# Altium schematic sheet B9_HashBoard.SchDoc
size A4
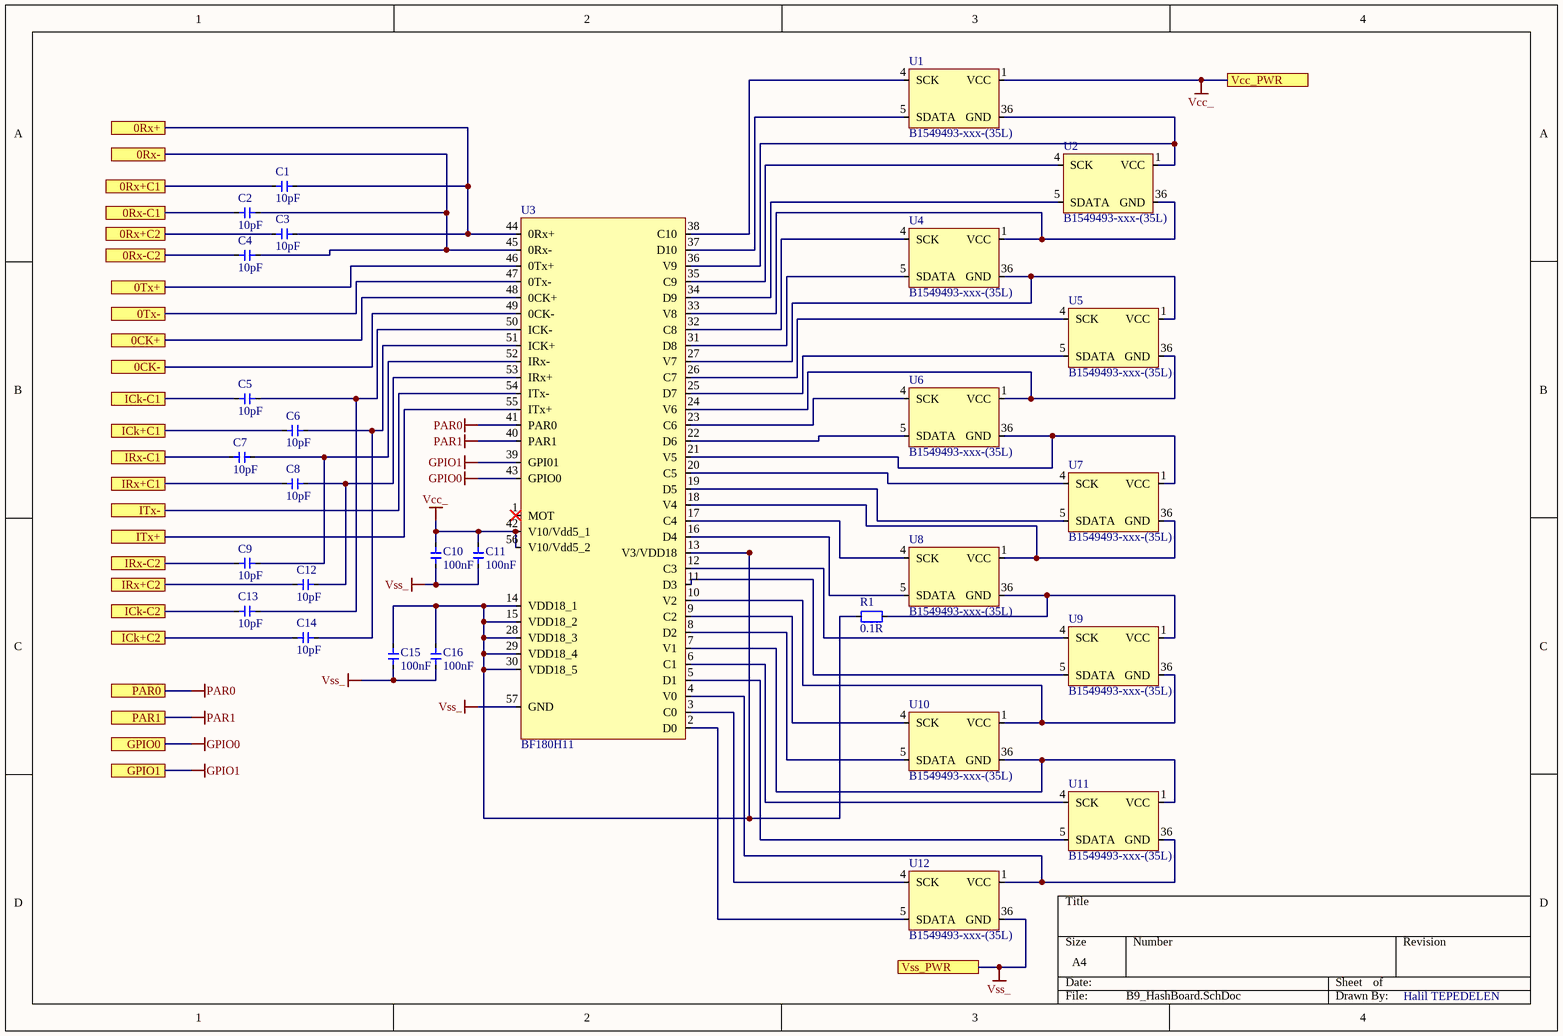
[diagram p0: B9_HashBoard.SchDoc]

## Parts
C1  10pF  [C-0402R]
C2  10pF  [C-0402R]
C3  10pF  [C-0402R]
C4  10pF  [C-0402R]
C5  10pF  [C-0402R]
C6  10pF  [C-0402R]
C7  10pF  [C-0402R]
C8  10pF  [C-0402R]
C9  10pF  [C-0402R]
C10  100nF  [C-0402R]
C11  100nF  [C-0402R]
C12  10pF  [C-0402R]
C13  10pF  [C-0402R]
C14  10pF  [C-0402R]
C15  100nF  [C-0402R]
C16  100nF  [C-0402R]
R1  0.1R  [R-0402R]
U1  B1549493-xxx-(35L)  [Bıtfury_Clarke_B1549493]
U2  B1549493-xxx-(35L)  [Bıtfury_Clarke_B1549493]
U3  BF180H11  [BF180H16]
U4  B1549493-xxx-(35L)  [Bıtfury_Clarke_B1549493]
U5  B1549493-xxx-(35L)  [Bıtfury_Clarke_B1549493]
U6  B1549493-xxx-(35L)  [Bıtfury_Clarke_B1549493]
U7  B1549493-xxx-(35L)  [Bıtfury_Clarke_B1549493]
U8  B1549493-xxx-(35L)  [Bıtfury_Clarke_B1549493]
U9  B1549493-xxx-(35L)  [Bıtfury_Clarke_B1549493]
U10  B1549493-xxx-(35L)  [Bıtfury_Clarke_B1549493]
U11  B1549493-xxx-(35L)  [Bıtfury_Clarke_B1549493]
U12  B1549493-xxx-(35L)  [Bıtfury_Clarke_B1549493]

## Ports
0CK+, 0CK-, 0Rx+, 0Rx+C1, 0Rx+C2, 0Rx-, 0Rx-C1, 0Rx-C2, 0Tx+, 0Tx-, GPIO0, GPIO1, ICk+C1, ICk+C2, ICk-C1, ICk-C2, IRx+C1, IRx+C2, IRx-C1, IRx-C2, ITx+, ITx-, PAR0, PAR1, Vcc_PWR, Vss_PWR

## Nets
GPIO0: U3.43(GPIO0) ; port GPIO0
GPIO1: U3.39(GPI01) ; port GPIO1
PAR0: U3.41(PAR0) ; port PAR0
PAR1: U3.40(PAR1) ; port PAR1
Vcc_: C10.2 C11.2 U1.1(VCC) U3.42(V10/Vdd5_1) U3.56(V10/Vdd5_2) ; port Vcc_PWR
Vss_: C10.1 C11.1 C15.1 C16.1 U3.57(GND) U12.36(GND) ; port Vss_PWR
0CK+: U3.48(0CK+) ; port 0CK+
0CK-: U3.49(0CK-) ; port 0CK-
0Rx+: C1.2 C3.2 U3.44(0Rx+) ; port 0Rx+
0Rx+C1: C1.1 ; port 0Rx+C1
0Rx+C2: C3.1 ; port 0Rx+C2
0Rx-: C2.2 C4.2 U3.45(0Rx-) ; port 0Rx-
0Rx-C1: C2.1 ; port 0Rx-C1
0Rx-C2: C4.1 ; port 0Rx-C2
0Tx+: U3.46(0Tx+) ; port 0Tx+
0Tx-: U3.47(0Tx-) ; port 0Tx-
ICk+C1: C6.1 ; port ICk+C1
ICk+C2: C14.1 ; port ICk+C2
ICk-C1: C5.1 ; port ICk-C1
ICk-C2: C13.1 ; port ICk-C2
IRx+C1: C8.1 ; port IRx+C1
IRx+C2: C12.1 ; port IRx+C2
IRx-C1: C7.1 ; port IRx-C1
IRx-C2: C9.1 ; port IRx-C2
ITx+: U3.55(ITx+) ; port ITx+
ITx-: U3.54(ITx-) ; port ITx-
NetC5_2: C5.2 C13.2 U3.50(ICK-)
NetC6_2: C6.2 C14.2 U3.51(ICK+)
NetC7_2: C7.2 C9.2 U3.52(IRx-)
NetC8_2: C8.2 C12.2 U3.53(IRx+)
NetC15_2: C15.2 C16.2 R1.1 U3.13(V3/VDD18) U3.14(VDD18_1) U3.15(VDD18_2) U3.28(VDD18_3) U3.29(VDD18_4) U3.30(VDD18_5)
NetR1_2: R1.2 U8.36(GND) U9.1(VCC)
NetU1_4: U1.4(SCK) U3.38(C10)
NetU1_5: U1.5(SDATA) U3.37(D10)
NetU1_36: U1.36(GND) U2.1(VCC) U3.36(V9)
NetU2_4: U2.4(SCK) U3.35(C9)
NetU2_5: U2.5(SDATA) U3.34(D9)
NetU2_36: U2.36(GND) U3.33(V8) U4.1(VCC)
NetU3_2: U3.2(D0) U12.5(SDATA)
NetU3_3: U3.3(C0) U12.4(SCK)
NetU3_4: U3.4(V0) U11.36(GND) U12.1(VCC)
NetU3_5: U3.5(D1) U11.5(SDATA)
NetU3_6: U3.6(C1) U11.4(SCK)
NetU3_7: U3.7(V1) U10.36(GND) U11.1(VCC)
NetU3_8: U3.8(D2) U10.5(SDATA)
NetU3_9: U3.9(C2) U10.4(SCK)
NetU3_10: U3.10(V2) U9.36(GND) U10.1(VCC)
NetU3_11: U3.11(D3) U9.5(SDATA)
NetU3_12: U3.12(C3) U9.4(SCK)
NetU3_16: U3.16(D4) U8.5(SDATA)
NetU3_17: U3.17(C4) U8.4(SCK)
NetU3_18: U3.18(V4) U7.36(GND) U8.1(VCC)
NetU3_19: U3.19(D5) U7.5(SDATA)
NetU3_20: U3.20(C5) U7.4(SCK)
NetU3_21: U3.21(V5) U6.36(GND) U7.1(VCC)
NetU3_22: U3.22(D6) U6.5(SDATA)
NetU3_23: U3.23(C6) U6.4(SCK)
NetU3_24: U3.24(V6) U5.36(GND) U6.1(VCC)
NetU3_25: U3.25(D7) U5.5(SDATA)
NetU3_26: U3.26(C7) U5.4(SCK)
NetU3_27: U3.27(V7) U4.36(GND) U5.1(VCC)
NetU3_31: U3.31(D8) U4.5(SDATA)
NetU3_32: U3.32(C8) U4.4(SCK)

Not connected (* = marked no-connect by the designer): U3 1(MOT)*

## Notes on the sheet
- Halil TEPEDELEN